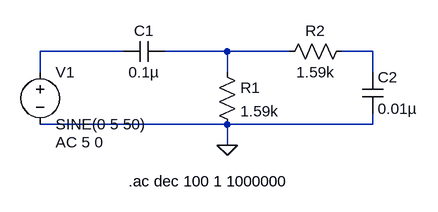
[diagram p0: schematic Band Pass Filter.asc]
Band Pass Filter.asc, the LTspice schematic file:
Version 4.1
SHEET 1 880 680
WIRE -672 96 -800 96
WIRE -512 96 -608 96
WIRE -416 96 -512 96
WIRE -288 96 -336 96
WIRE -800 128 -800 96
WIRE -512 128 -512 96
WIRE -288 128 -288 96
WIRE -512 208 -800 208
WIRE -288 208 -288 192
WIRE -288 208 -512 208
WIRE -512 240 -512 208
FLAG -512 240 0
SYMBOL voltage -800 112 R0
WINDOW 123 24 124 Left 2
WINDOW 39 0 0 Left 0
SYMATTR Value2 AC 5 0
SYMATTR InstName V1
SYMATTR Value SINE(0 5 50)
SYMBOL cap -608 80 R90
WINDOW 0 0 32 VBottom 2
WINDOW 3 32 32 VTop 2
SYMATTR InstName C1
SYMATTR Value 0.1µ
SYMBOL res -528 112 R0
SYMATTR InstName R1
SYMATTR Value 1.59k
SYMBOL res -320 80 R90
WINDOW 0 0 56 VBottom 2
WINDOW 3 32 56 VTop 2
SYMATTR InstName R2
SYMATTR Value 1.59k
SYMBOL cap -304 128 R0
SYMATTR InstName C2
SYMATTR Value 0.01µ
TEXT -664 296 Left 2 !.ac dec 100 1 1000000

The netlist it stands for:
* Band Pass Filter.asc
V1 N001 0 SINE(0 5 50) AC 5 0
C1 N002 N001 0.1µ
R1 N002 0 1.59k
R2 N003 N002 1.59k
C2 N003 0 0.01µ
.ac dec 100 1 1000000
.backanno
.end